# Altium schematic sheet ServoController.SchDoc
size B
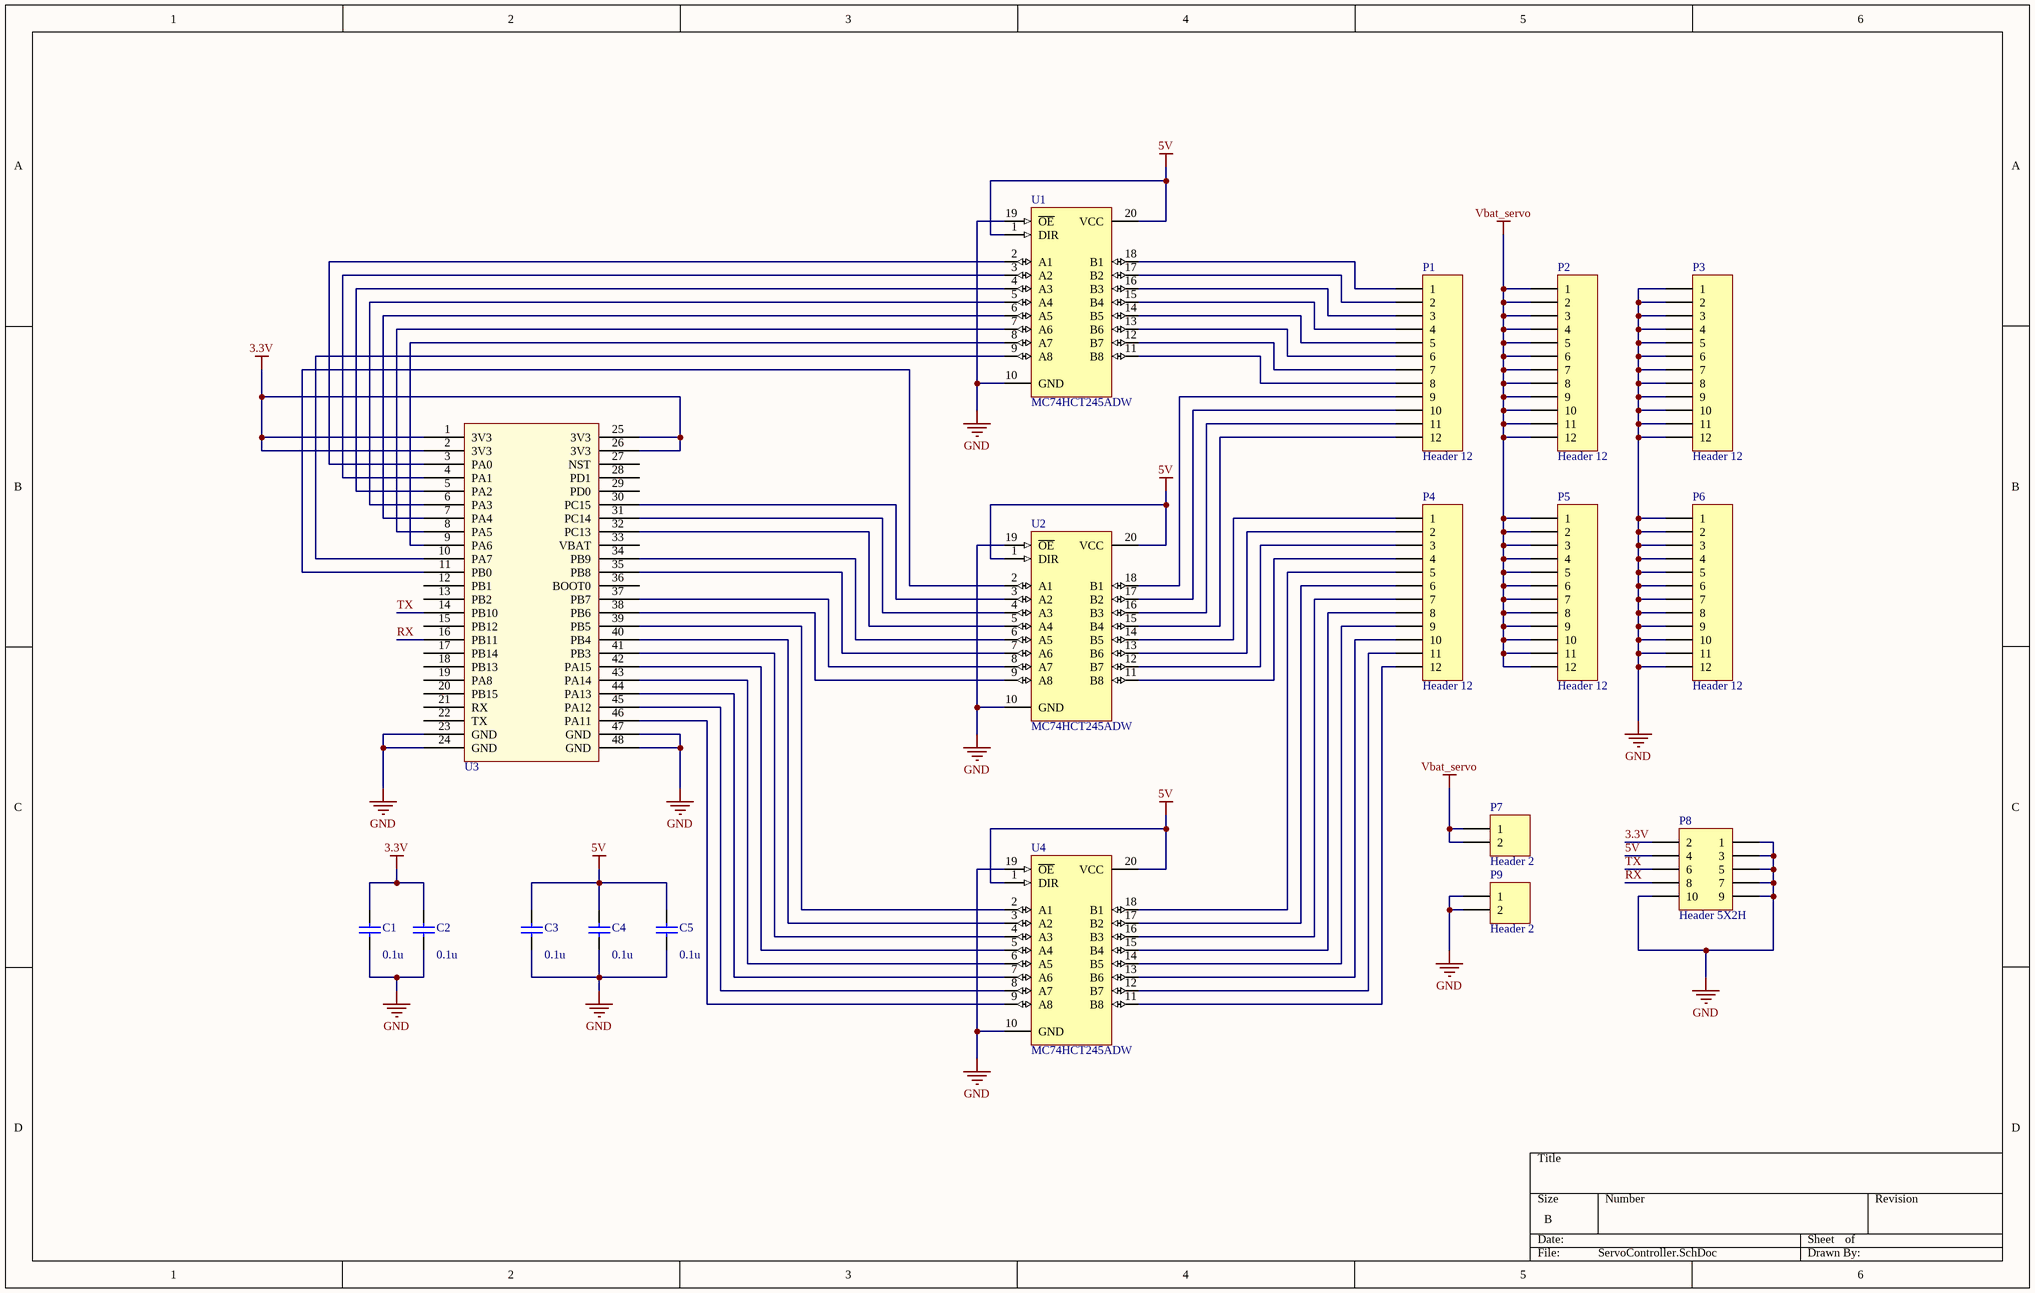
[diagram p0: ServoController.SchDoc]

## Parts
C1  value 0.1u  [C1206]  (hidden comment: Cap Semi)
C2  value 0.1u  [C1206]  (hidden comment: Cap Semi)
C3  value 0.1u  [C1206]  (hidden comment: Cap Semi)
C4  value 0.1u  [C1206]  (hidden comment: Cap Semi)
C5  value 0.1u  [C1206]  (hidden comment: Cap Semi)
P1  Header 12  [HDR1X12]
P2  Header 12  [HDR1X12]
P3  Header 12  [HDR1X12]
P4  Header 12  [HDR1X12]
P5  Header 12  [HDR1X12]
P6  Header 12  [HDR1X12]
P7  Header 2  [HDR1X2]
P8  Header 5X2H  [HDR2X5H]
P9  Header 2  [HDR1X2]
U1  MC74HCT245ADW  [751D-05_N]
U2  MC74HCT245ADW  [751D-05_N]
U3  STM32F103C8T6_Module  [STM32F103C8T6_Module]  (value not drawn)
U4  MC74HCT245ADW  [751D-05_N]

## Nets
3.3V: C1.2 C2.2 P8.2 U3.1(3V3) U3.2(3V3) U3.25(3V3) U3.26(3V3)
5V: C3.2 C4.2 C5.2 P8.4 U1.1(DIR) U1.20(VCC) U2.1(DIR) U2.20(VCC) U4.1(DIR) U4.20(VCC)
GND: C1.1 C2.1 C3.1 C4.1 C5.1 P3.1 P3.2 P3.3 P3.4 P3.5 P3.6 P3.7 P3.8 P3.9 P3.10 P3.11 P3.12 P6.1 P6.2 P6.3 P6.4 P6.5 P6.6 P6.7 P6.8 P6.9 P6.10 P6.11 P6.12 P8.1 P8.3 P8.5 P8.7 P8.9 P8.10 P9.1 P9.2 U1.10(GND) U1.19(~{OE}) U2.10(GND) U2.19(~{OE}) U3.23(GND) U3.24(GND) U3.47(GND) U3.48(GND) U4.10(GND) U4.19(~{OE})
Vbat_servo: P2.1 P2.2 P2.3 P2.4 P2.5 P2.6 P2.7 P2.8 P2.9 P2.10 P2.11 P2.12 P5.1 P5.2 P5.3 P5.4 P5.5 P5.6 P5.7 P5.8 P5.9 P5.10 P5.11 P5.12 P7.1 P7.2
RX: P8.8 U3.16(PB11)
TX: P8.6 U3.14(PB10)
NetP1_1: P1.1 U1.18(B1)
NetP1_2: P1.2 U1.17(B2)
NetP1_3: P1.3 U1.16(B3)
NetP1_4: P1.4 U1.15(B4)
NetP1_5: P1.5 U1.14(B5)
NetP1_6: P1.6 U1.13(B6)
NetP1_7: P1.7 U1.12(B7)
NetP1_8: P1.8 U1.11(B8)
NetP1_9: P1.9 U2.18(B1)
NetP1_10: P1.10 U2.17(B2)
NetP1_11: P1.11 U2.16(B3)
NetP1_12: P1.12 U2.15(B4)
NetP4_1: P4.1 U2.14(B5)
NetP4_2: P4.2 U2.13(B6)
NetP4_3: P4.3 U2.12(B7)
NetP4_4: P4.4 U2.11(B8)
NetP4_5: P4.5 U4.18(B1)
NetP4_6: P4.6 U4.17(B2)
NetP4_7: P4.7 U4.16(B3)
NetP4_8: P4.8 U4.15(B4)
NetP4_9: P4.9 U4.14(B5)
NetP4_10: P4.10 U4.13(B6)
NetP4_11: P4.11 U4.12(B7)
NetP4_12: P4.12 U4.11(B8)
NetU1_2: U1.2(A1) U3.3(PA0)
NetU1_3: U1.3(A2) U3.4(PA1)
NetU1_4: U1.4(A3) U3.5(PA2)
NetU1_5: U1.5(A4) U3.6(PA3)
NetU1_6: U1.6(A5) U3.7(PA4)
NetU1_7: U1.7(A6) U3.8(PA5)
NetU1_8: U1.8(A7) U3.9(PA6)
NetU1_9: U1.9(A8) U3.10(PA7)
NetU2_2: U2.2(A1) U3.11(PB0)
NetU2_3: U2.3(A2) U3.30(PC15)
NetU2_4: U2.4(A3) U3.31(PC14)
NetU2_5: U2.5(A4) U3.32(PC13)
NetU2_6: U2.6(A5) U3.34(PB9)
NetU2_7: U2.7(A6) U3.35(PB8)
NetU2_8: U2.8(A7) U3.37(PB7)
NetU2_9: U2.9(A8) U3.38(PB6)
NetU3_39: U3.39(PB5) U4.2(A1)
NetU3_40: U3.40(PB4) U4.3(A2)
NetU3_41: U3.41(PB3) U4.4(A3)
NetU3_42: U3.42(PA15) U4.5(A4)
NetU3_43: U3.43(PA14) U4.6(A5)
NetU3_44: U3.44(PA13) U4.7(A6)
NetU3_45: U3.45(PA12) U4.8(A7)
NetU3_46: U3.46(PA11) U4.9(A8)

Not connected (* = marked no-connect by the designer): U3 12(PB1) 13(PB2) 15(PB12) 17(PB14) 18(PB13) 19(PA8) 20(PB15) 21(RX) 22(TX) 27(NST) 28(PD1) 29(PD0) 33(VBAT) 36(BOOT0)

## Library data of the parts
C1-C5 = Cap Semi: Capacitor (Semiconductor SIM Model); Published: 8-Jun-2000; LatestRevisionDate: 29-May-2009; LatestRevisionNote: IPC-7351 Footprint Added.; PackageReference: C1206; Publisher: Altium Limited; PackageDescription: Chip Capacitor
P1-P6 = Header 12: Header, 12-Pin; LatestRevisionDate: 17-Jul-2002; LatestRevisionNote: Re-released for DXP Platform.; Publisher: Altium Limited
P7 P9 = Header 2: Header, 2-Pin; LatestRevisionDate: 17-Jul-2002; LatestRevisionNote: Re-released for DXP Platform.; Publisher: Altium Limited
P8 = Header 5X2H: Header, 5-Pin, Dual row, Right Angle; LatestRevisionDate: 17-Jul-2002; LatestRevisionNote: Re-released for DXP Platform.; Publisher: Altium Limited
U1 U2 U4 = MC74HCT245ADW: Octal 3-State Non-Inverting Bus Transceiver with LSTTL-Compatible Inputs; Published: 15-Apr-2002; LatestRevisionDate: 13-Apr-2006; LatestRevisionNote: IPC-7351 Footprint Added.; DatasheetVersion: Mar-2000; PackageReference: 751D-05; Publisher: Altium Limited; PackageDescription: 20-Pin Small Outline Integrated Circuit 1.27 mm Pitch; ComponentLink1Description: Manufacturer Link; ComponentLink1URL: http://www.onsemi.com/; ComponentLink2Description: Datasheet; ComponentLink2URL: http://www.onsemi.com/pub/Collateral/MC74HCT245A-D.PDF